# Altium project e30 lcd.PrjPcb
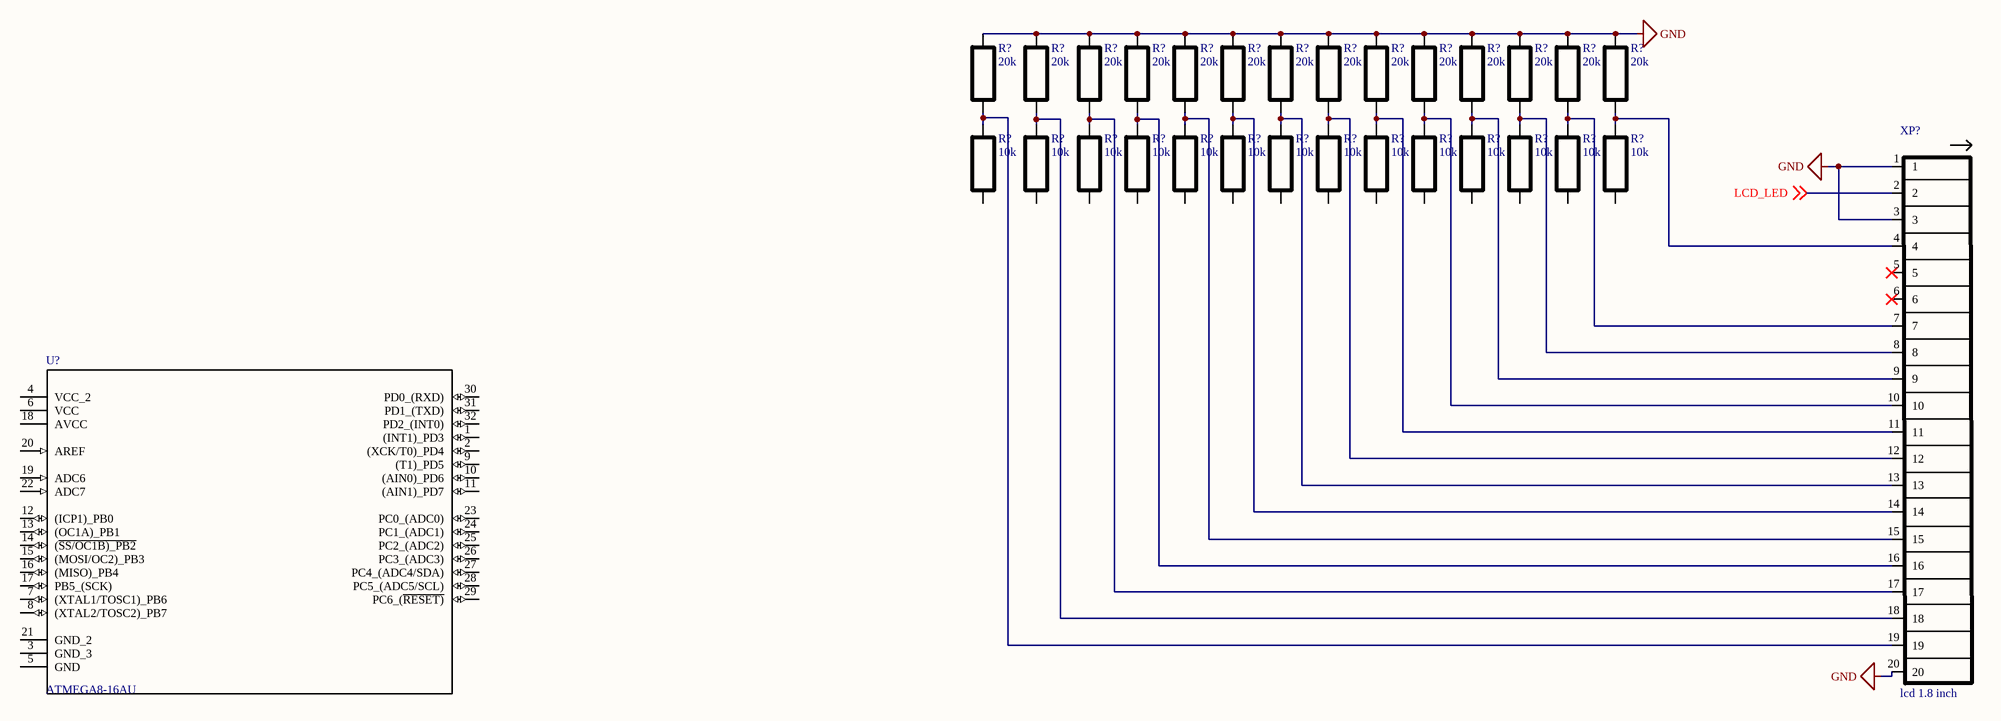
[diagram p0: Converter.SchDoc]
1 sheet, 30 parts. Net scope: global (net labels, ports and power ports of the same name join across sheets).

## Sheet Converter.SchDoc: {Наименование}
size 420 x 297 mm; ApprovedBy: {Утвердил}; CheckedBy: {Проверил}; DrawnBy: {Разработал}; Engineer: {Инженер}; DocumentNumber: {Обозначение}; SheetNumber: {}; SheetTotal: {}; Scale: {Масш.}; Title1str: {Наименование}; PageSetup: Record=PageOptions|CenterHorizontal=False|CenterVertical=False|PrintScale=0.95|XCorrection=0.00|YCorrection=0.00|PrintKind=1|BorderSize=5000000|LeftOffset=0|BottomOffset=0|Orientation=1|PaperLength=1000|PaperWidth=1000|Scale=100|PaperSource=15|PrintQuality=600|MediaType=1|DitherType=10|PaperKind=A4|PrintScaleMode=1; Title2str: {Наименование}; ProcessInspection: {Т.контр.}; Mass: {Масса}; NormInspection: {Н.контр.}; EngineerName: {Инженер}; Letter1Column: {}; Letter2Column: {}; Letter3Column: {}; DocumentType: {Документ}; DocumentType1str: {Документ}; DocumentType2str: {Документ}; ImagePath: {Перв. применение}; Rule: PcbType=ProtelPcb

### Parts
(Parts that share a designator on the sheet are numbered #1, #2 ... from top to bottom, then left to right.)
R?#1  20k  [CR2012-0805]
R?#2  20k  [CR2012-0805]
R?#3  20k  [CR2012-0805]
R?#4  20k  [CR2012-0805]
R?#5  20k  [CR2012-0805]
R?#6  20k  [CR2012-0805]
R?#7  20k  [CR2012-0805]
R?#8  20k  [CR2012-0805]
R?#9  20k  [CR2012-0805]
R?#10  20k  [CR2012-0805]
R?#11  20k  [CR2012-0805]
R?#12  20k  [CR2012-0805]
R?#13  20k  [CR2012-0805]
R?#14  20k  [CR2012-0805]
R?#15  10k  [CR2012-0805]
R?#16  10k  [CR2012-0805]
R?#17  10k  [CR2012-0805]
R?#18  10k  [CR2012-0805]
R?#19  10k  [CR2012-0805]
R?#20  10k  [CR2012-0805]
R?#21  10k  [CR2012-0805]
R?#22  10k  [CR2012-0805]
R?#23  10k  [CR2012-0805]
R?#24  10k  [CR2012-0805]
R?#25  10k  [CR2012-0805]
R?#26  10k  [CR2012-0805]
R?#27  10k  [CR2012-0805]
R?#28  10k  [CR2012-0805]
U?  ATMEGA8-16AU  [*QFP80P900X900X120-32N]
XP?  lcd 1.8 inch  [1.8 inch lcd footprint]

### Nets
GND: R?#1.1 R?#2.1 R?#3.1 R?#4.1 R?#5.1 R?#6.1 R?#7.1 R?#8.1 R?#9.1 R?#10.1 R?#11.1 R?#12.1 R?#13.1 R?#14.1 XP?.1 XP?.3 XP?.20
LCD_LED: XP?.2 ; off-sheet LCD_LED
NetR?#1_2: R?#1.2 R?#15.1 XP?.19
NetR?#2_2: R?#2.2 R?#16.1 XP?.18
NetR?#3_2: R?#3.2 R?#17.1 XP?.17
NetR?#4_2: R?#4.2 R?#18.1 XP?.16
NetR?#5_2: R?#5.2 R?#19.1 XP?.15
NetR?#6_2: R?#6.2 R?#20.1 XP?.14
NetR?#7_2: R?#7.2 R?#21.1 XP?.13
NetR?#8_2: R?#8.2 R?#22.1 XP?.12
NetR?#9_2: R?#9.2 R?#23.1 XP?.11
NetR?#10_2: R?#10.2 R?#24.1 XP?.10
NetR?#11_2: R?#11.2 R?#25.1 XP?.9
NetR?#12_2: R?#12.2 R?#26.1 XP?.8
NetR?#13_2: R?#13.2 R?#27.1 XP?.7
NetR?#14_2: R?#14.2 R?#28.1 XP?.4

Not connected (* = marked no-connect by the designer): R?#15 2; R?#16 2; R?#17 2; R?#18 2; R?#19 2; R?#20 2; R?#21 2; R?#22 2; R?#23 2; R?#24 2; R?#25 2; R?#26 2; R?#27 2; R?#28 2; U? 1((INT1)_PD3) 2((XCK/T0)_PD4) 3(GND_3) 4(VCC_2) 5(GND) 6(VCC) 7((XTAL1/TOSC1)_PB6) 8((XTAL2/TOSC2)_PB7) 9((T1)_PD5) 10((AIN0)_PD6) 11((AIN1)_PD7) 12((ICP1)_PB0) 13((OC1A)_PB1) 14((~{SS/OC1B)_PB2}) 15((MOSI/OC2)_PB3) 16((MISO)_PB4) 17(PB5_(SCK)) 18(AVCC) 19(ADC6) 20(AREF) 21(GND_2) 22(ADC7) 23(PC0_(ADC0)) 24(PC1_(ADC1)) 25(PC2_(ADC2)) 26(PC3_(ADC3)) 27(PC4_(ADC4/SDA)) 28(PC5_(ADC5/SCL)) 29(PC6_(~{RESET)}) 30(PD0_(RXD)) 31(PD1_(TXD)) 32(PD2_(INT0)); XP? 5* 6*

### Notes on the sheet
- Перв. примен.
- Справ. №
- Подп. и дата
- Инв. № дубл.
- Взам. инв. №
- Изм.
- Лист
- № докум.
- Подп.
- Дата
- Лит.
- Масса
- Масштаб
- Т.контр.
- Пров.
- Разраб.
- Листов
- Инв. № подл.
- Н.контр.
- Утв.
- Копировал
- Формат А3

### Library data of the parts
R?#1-R?#28 = R0805-10k-5%
U? = ATMEGA8-16AU: / AVR AVRВ® ATmega Microcontroller IC 8-Bit 16MHz 8KB _4K x 16_ FLASH 32-TQFP _7x7_ /; MF: Microchip Technology; SnapEDA_Link: https://www.snapeda.com/parts/ATMEGA8-16AU/Microchip/view-part/4246640/?ref=snap; Price: None; MP: ATMEGA8-16AU; Availability: Unavailable; Package: TQFP-32 Microchip Technology; Value: *
XP? = 1.8 inch 20 pin lcd